# EAGLE schematic SHUTDOWN_EXTERNAL (EAGLE 8.4.1)
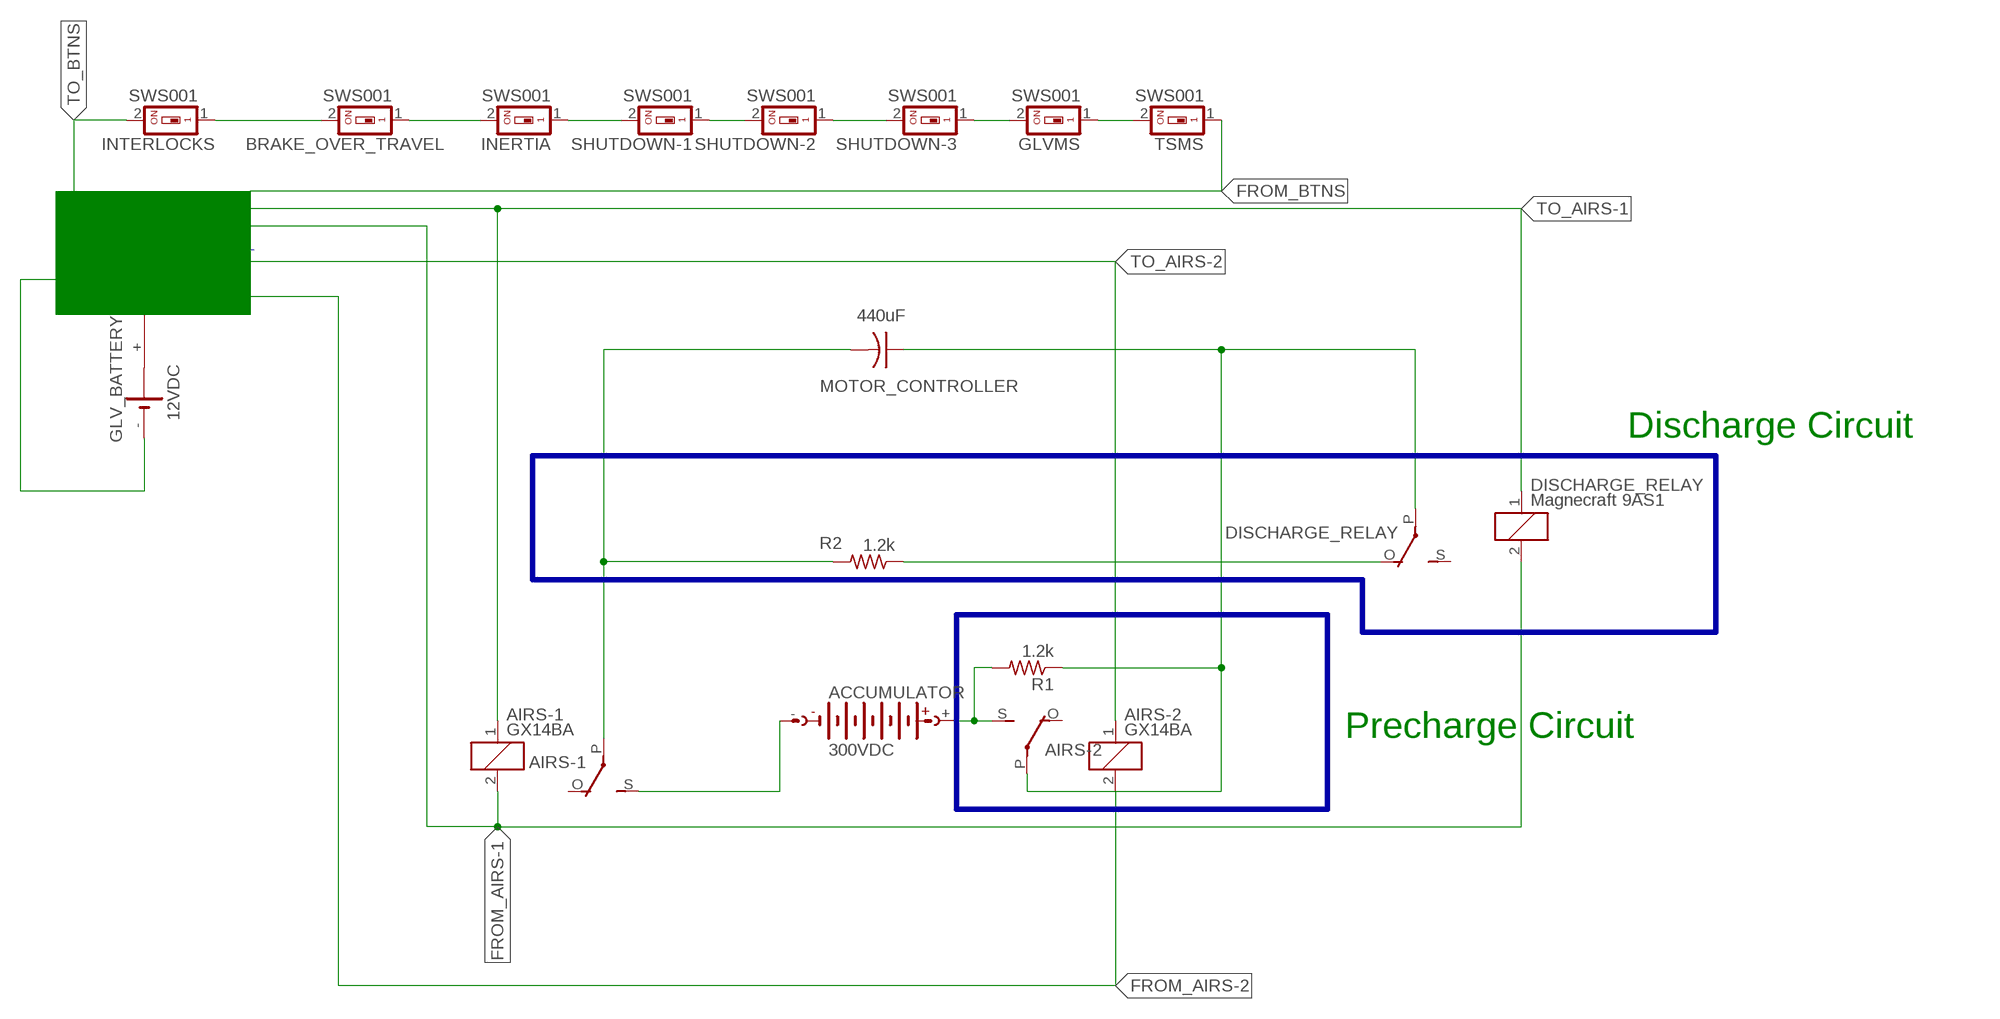
[diagram p0: schematic, sheet 1]

## Parts
ACCUMULATOR  300VDC  AB9V  [AB9V]
AIRS-1  GX14BA  V23127A  [V23127A]
AIRS-2  GX14BA  V23127A  [V23127A]
BRAKE_OVER_TRAVEL  SWS001  [SMS-001]
DISCHARGE_RELAY  Magnecraft 9AS1  V23127A  [V23127A]
GLV_BATTERY  12VDC  B2430UNI  [B2430UNI]
GLVMS  SWS001  [SMS-001]
INERTIA  SWS001  [SMS-001]
INTERLOCKS  SWS001  [SMS-001]
MOTOR_CONTROLLER  440uF  C-US025-024X044  [C025-024X044]
R1  1.2k  R-US_0411/15  [0411/15]
R2  1.2k  R-US_0411/15  [0411/15]
SHUTDOWN-1  SWS001  [SMS-001]
SHUTDOWN-2  SWS001  [SMS-001]
SHUTDOWN-3  SWS001  [SMS-001]
TSMS  SWS001  [SMS-001]

## Nets
FROM_AIRS-1: AIRS-1.2 DISCHARGE_RELAY.2
FROM_AIRS-2: AIRS-2.2
FROM_BTNS: TSMS.1
N$1: GLV_BATTERY.-
N$2: BRAKE_OVER_TRAVEL.1 INERTIA.2
N$3: INERTIA.1 SHUTDOWN-1.2
N$4: SHUTDOWN-1.1 SHUTDOWN-2.2
N$5: SHUTDOWN-2.1 SHUTDOWN-3.2
N$6: GLVMS.2 SHUTDOWN-3.1
N$7: GLVMS.1 TSMS.2
N$8: BRAKE_OVER_TRAVEL.2 INTERLOCKS.1
N$12: ACCUMULATOR.- AIRS-1.S(2:S)
N$14: ACCUMULATOR.+ AIRS-2.S(2:S) R1.2
N$16: AIRS-2.P(2:P) DISCHARGE_RELAY.P(2:P) MOTOR_CONTROLLER.1 R1.1
N$17: AIRS-1.P(2:P) MOTOR_CONTROLLER.2 R2.2
N$18: DISCHARGE_RELAY.O(2:O) R2.1
TO_AIRS-1: AIRS-1.1 DISCHARGE_RELAY.1
TO_AIRS-2: AIRS-2.1
TO_BTNS: INTERLOCKS.2
Unconnected: AIRS-1.O(2:O) AIRS-2.O(2:O) DISCHARGE_RELAY.S(2:S) GLV_BATTERY.+ GLV_BATTERY.+@1(+) GLV_BATTERY.+@2(+) GLV_BATTERY.+@3(+) GLV_BATTERY.+@4(+) GLV_BATTERY.-@1(-)

## Buses
B$1
B$2

## Notes on the sheet
- SHUTDOWN CIRCUIT
- Discharge Circuit
- Precharge Circuit

## Library data of the parts
ACCUMULATOR = battery:AB9V: 9-V BATTERY CLIP
AIRS-1 AIRS-2 DISCHARGE_RELAY = relay:V23127A: RELAY horizontal, 1 x switch, 5 A/300 V DC, 250 V AC, Siemens; OC_FARNELL: unknown; OC_NEWARK: unknown
BRAKE_OVER_TRAVEL GLVMS INERTIA INTERLOCKS SHUTDOWN-1-SHUTDOWN-3 TSMS = smd-special:SWS001: SMD Dip Switch 1 pol.
GLV_BATTERY = battery:B2430UNI: LI BATTERY
MOTOR_CONTROLLER = rcl:C-US: CAPACITOR, American symbol; SPICEPREFIX: C
R1 R2 = rcl:R-US_: RESISTOR, American symbol; SPICEPREFIX: R